# Altium schematic sheet lilred_management_board.SchDoc
size Letter; CompanyName: Carnegie Mellon University; Organization: Carnegie Mellon University; Address1: Carnegie Mellon University; Address2: Robotics Institute; Address3: 5000 Forbes Ave., 4208 NSH; Address4: Pittsburgh, PA 15213; DocumentNumber: 1; Revision: 1.0; SheetNumber: 1; SheetTotal: 8; PageSetup: Record=PageOptions|CenterHorizontal=True|CenterVertical=True|PrintScale=1.00|XCorrection=1.00|YCorrection=1.00|PrintKind=0|BorderSize=5000000|LeftOffset=0|BottomOffset=0|Orientation=2|PaperLength=1000|PaperWidth=1000|Scale=100|PaperSource=7|PrintQuality=-4|MediaType=1|DitherType=10|PaperKind=Letter|PrintScaleMode=1
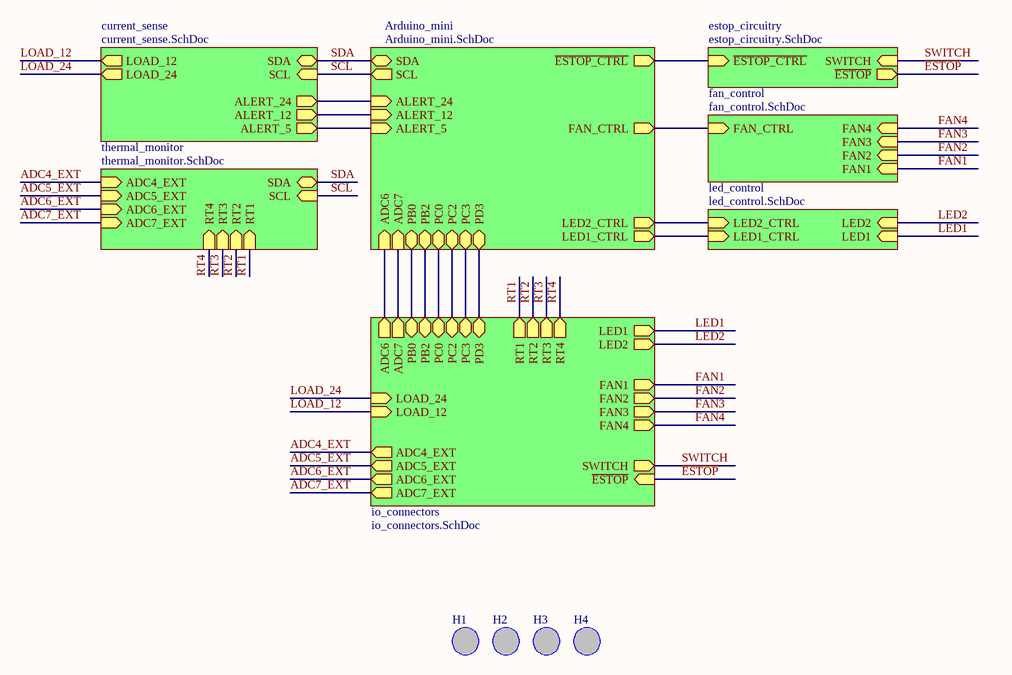
[diagram p0: lilred_management_board.SchDoc]

## Parts
H1  Standoff  [4-40 Panhead Standoff]  (value not drawn)
H2  Standoff  [4-40 Panhead Standoff]  (value not drawn)
H3  Standoff  [4-40 Panhead Standoff]  (value not drawn)
H4  Standoff  [4-40 Panhead Standoff]  (value not drawn)

## Sub-sheets
Arduino_mini = Arduino_mini.SchDoc: SDA (bidir), SCL (out), LED1_CTRL (out), LED2_CTRL (out), FAN_CTRL (out), ~{ESTOP_CTRL} (out), ADC6 (in), ADC7 (in), PB0 (bidir), PB2 (bidir), PC0 (bidir), PC2 (bidir), PC3 (bidir), PD3 (bidir), ALERT_24 (in), ALERT_12 (in), ALERT_5 (in)
current_sense = current_sense.SchDoc: SDA (bidir), SCL (in), LOAD_12 (out), LOAD_24 (out), ALERT_24 (out), ALERT_12 (out), ALERT_5 (out)
estop_circuitry = estop_circuitry.SchDoc: ~{ESTOP_CTRL} (in), ~{ESTOP} (out), SWITCH (in)
fan_control = fan_control.SchDoc: FAN_CTRL (in), FAN4 (in), FAN3 (in), FAN2 (in), FAN1 (in)
io_connectors = io_connectors.SchDoc: LOAD_24 (in), LOAD_12 (in), LED1 (out), LED2 (out), FAN1 (out), FAN2 (out), FAN3 (out), FAN4 (out), SWITCH (out), ~{ESTOP} (in), ADC4_EXT (out), ADC5_EXT (out), ADC6_EXT (out), ADC7_EXT (out), ADC6 (out), ADC7 (out), PB0 (bidir), PB2 (bidir), PC0 (bidir), PC2 (bidir), RT1 (out), RT2 (out), RT3 (out), RT4 (out), PD3 (bidir), PC3 (bidir)
led_control = led_control.SchDoc: LED2_CTRL (in), LED1_CTRL (in), LED2 (in), LED1 (in)
thermal_monitor = thermal_monitor.SchDoc: SDA (bidir), SCL (in), ADC4_EXT (in), ADC5_EXT (in), ADC6_EXT (in), ADC7_EXT (in), RT4 (in), RT3 (in), RT2 (in), RT1 (in)

## Nets
ADC4_EXT: sheet thermal_monitor/ADC4_EXT, sheet io_connectors/ADC4_EXT
ADC5_EXT: sheet thermal_monitor/ADC5_EXT, sheet io_connectors/ADC5_EXT
ADC6_EXT: sheet thermal_monitor/ADC6_EXT, sheet io_connectors/ADC6_EXT
ADC7_EXT: sheet thermal_monitor/ADC7_EXT, sheet io_connectors/ADC7_EXT
~{ESTOP}: sheet estop_circuitry/~{ESTOP}, sheet io_connectors/~{ESTOP}
FAN1: sheet fan_control/FAN1, sheet io_connectors/FAN1
FAN2: sheet fan_control/FAN2, sheet io_connectors/FAN2
FAN3: sheet fan_control/FAN3, sheet io_connectors/FAN3
FAN4: sheet fan_control/FAN4, sheet io_connectors/FAN4
LED1: sheet led_control/LED1, sheet io_connectors/LED1
LED2: sheet led_control/LED2, sheet io_connectors/LED2
LOAD_12: sheet current_sense/LOAD_12, sheet io_connectors/LOAD_12
LOAD_24: sheet current_sense/LOAD_24, sheet io_connectors/LOAD_24
RT1: sheet thermal_monitor/RT1, sheet io_connectors/RT1
RT2: sheet thermal_monitor/RT2, sheet io_connectors/RT2
RT3: sheet thermal_monitor/RT3, sheet io_connectors/RT3
RT4: sheet thermal_monitor/RT4, sheet io_connectors/RT4
SCL: sheet Arduino_mini/SCL, sheet current_sense/SCL, sheet thermal_monitor/SCL
SDA: sheet Arduino_mini/SDA, sheet current_sense/SDA, sheet thermal_monitor/SDA
SWITCH: sheet estop_circuitry/SWITCH, sheet io_connectors/SWITCH
(unnamed): sheet Arduino_mini/LED1_CTRL, sheet led_control/LED1_CTRL
(unnamed): sheet Arduino_mini/LED2_CTRL, sheet led_control/LED2_CTRL
(unnamed): sheet Arduino_mini/FAN_CTRL, sheet fan_control/FAN_CTRL
(unnamed): sheet Arduino_mini/~{ESTOP_CTRL}, sheet estop_circuitry/~{ESTOP_CTRL}
(unnamed): sheet Arduino_mini/ADC6, sheet io_connectors/ADC6
(unnamed): sheet Arduino_mini/ADC7, sheet io_connectors/ADC7
(unnamed): sheet Arduino_mini/PB0, sheet io_connectors/PB0
(unnamed): sheet Arduino_mini/PB2, sheet io_connectors/PB2
(unnamed): sheet Arduino_mini/PC0, sheet io_connectors/PC0
(unnamed): sheet Arduino_mini/PC2, sheet io_connectors/PC2
(unnamed): sheet Arduino_mini/PC3, sheet io_connectors/PC3
(unnamed): sheet Arduino_mini/PD3, sheet io_connectors/PD3
(unnamed): sheet Arduino_mini/ALERT_24, sheet current_sense/ALERT_24
(unnamed): sheet Arduino_mini/ALERT_12, sheet current_sense/ALERT_12
(unnamed): sheet Arduino_mini/ALERT_5, sheet current_sense/ALERT_5

## Notes on the sheet
- Title
- Size:
- Date:
- Letter
- Number:
- Time:
- Revision:
- Sheet
- of
- File: